# Altium project HELIA Lights 2022 V1.0.PrjPcb
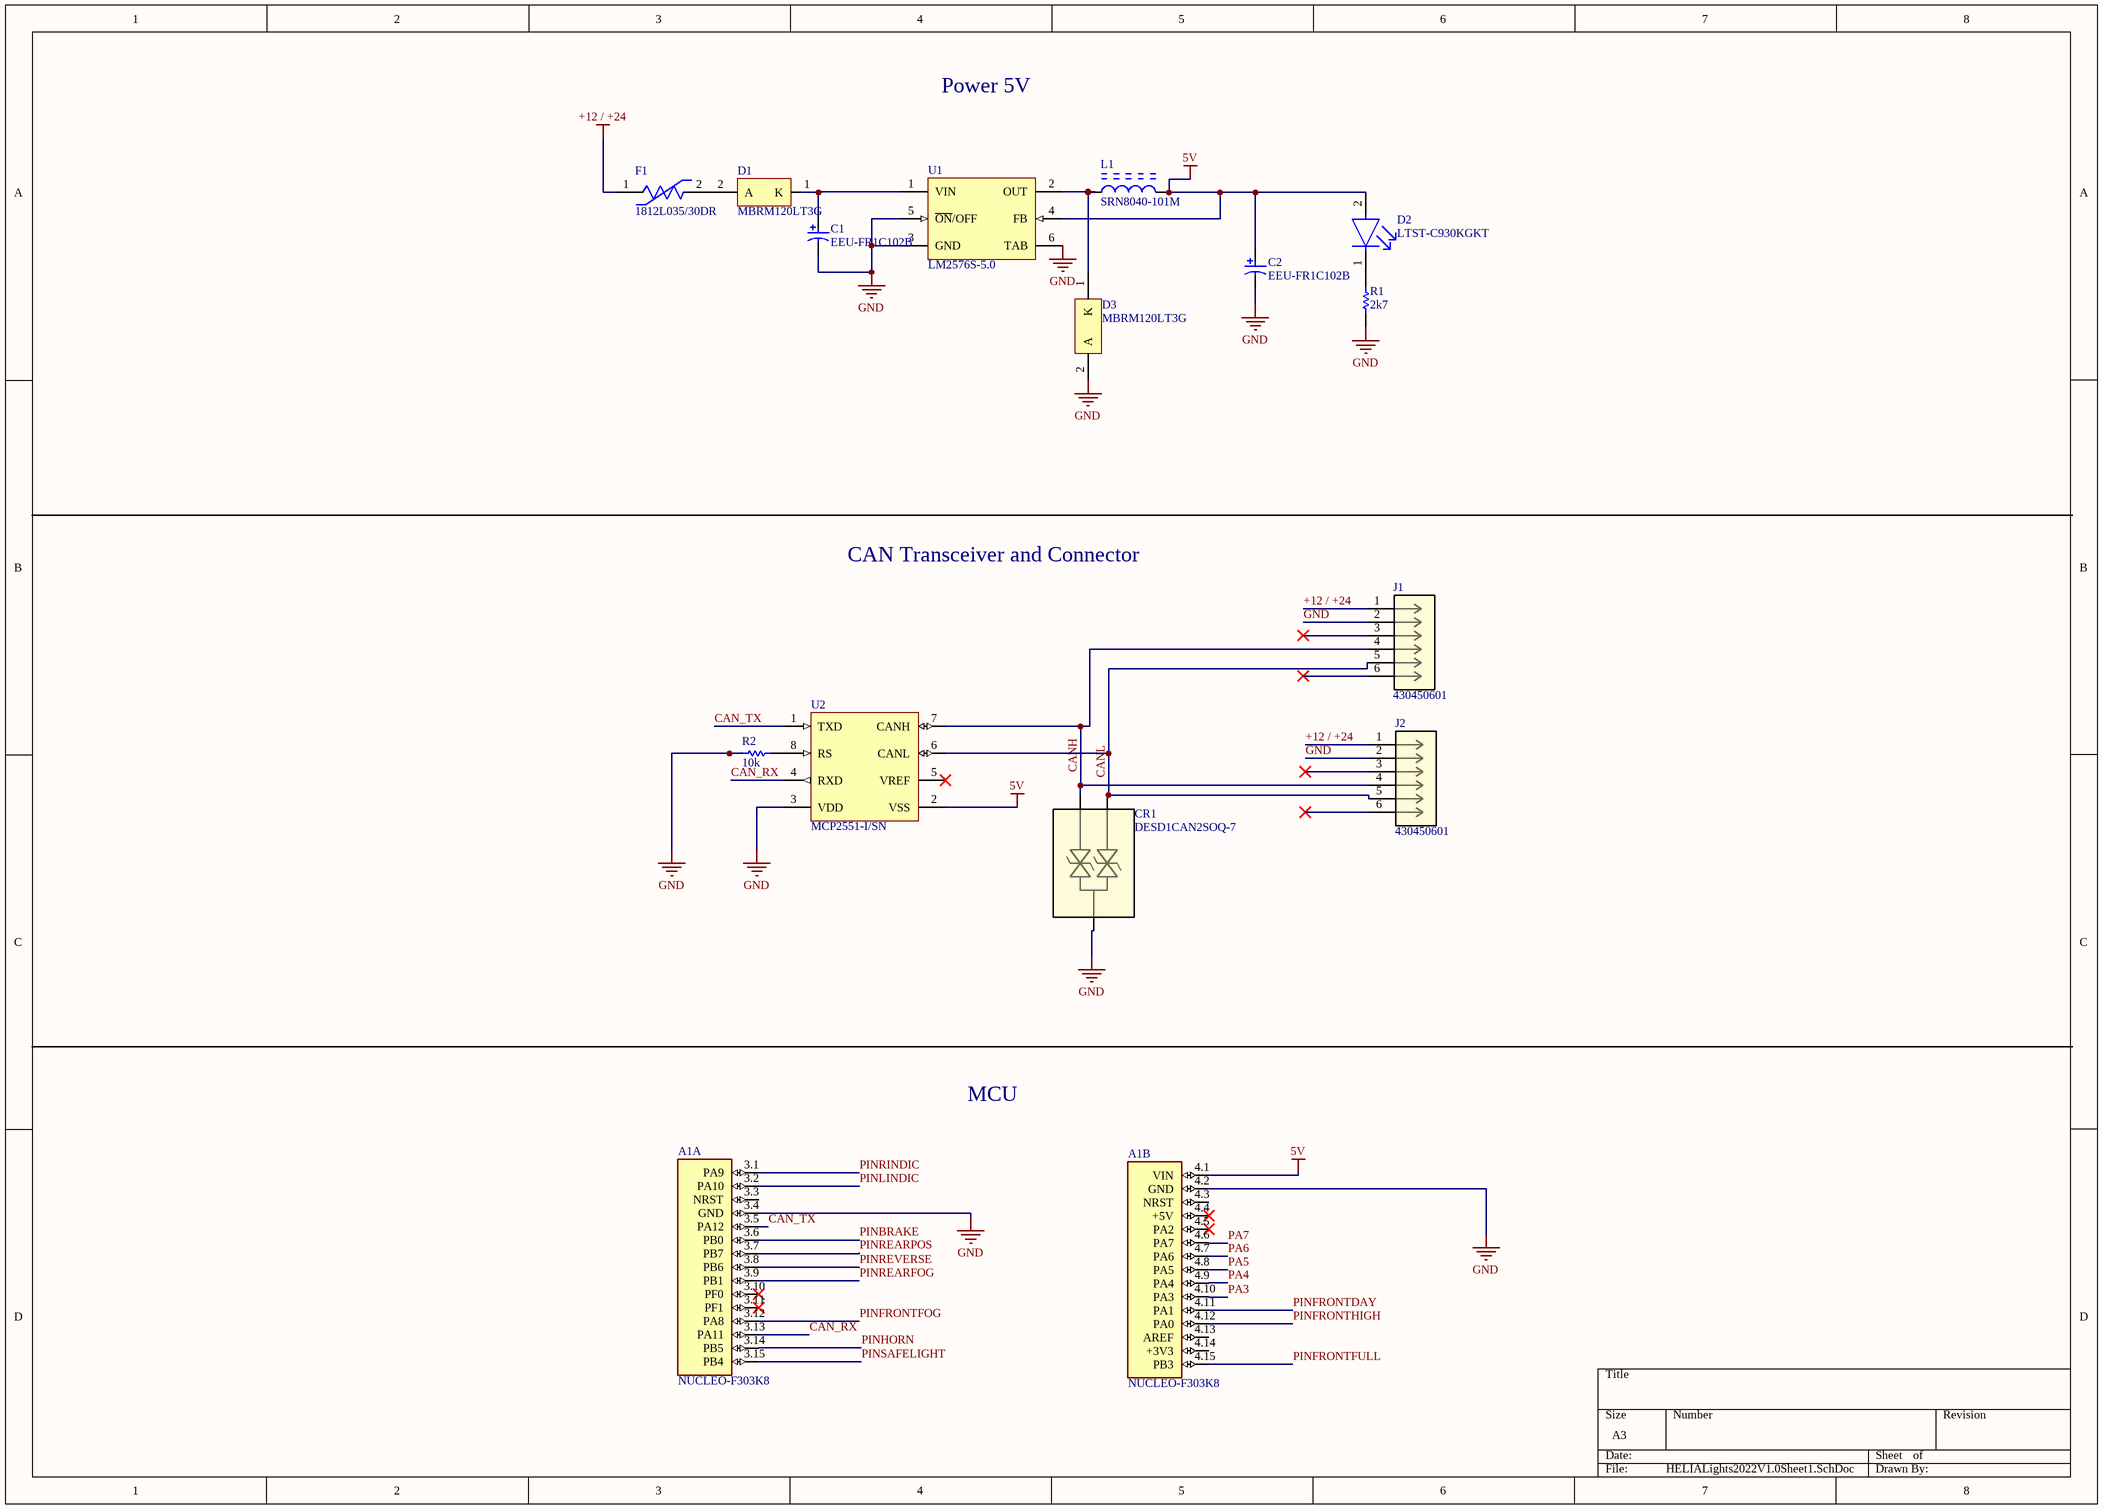
[diagram p0: HELIALights2022V1.0Sheet1.SchDoc]
2 sheets, 70 parts. Net scope: global (net labels, ports and power ports of the same name join across sheets).
Board file: HELIA Lights 2022 V1.0.PcbDoc
Sheets:
  HELIALights2022V1.0Sheet1.SchDoc
  HELIALights2022V1.0Sheet2.SchDoc

## Sheet HELIALights2022V1.0Sheet1.SchDoc: HELIA Lights
size A3; Author: Jeremias Pohle; CompanyName: CUER; DrawnBy: Jeremias Pohle; Engineer: Jeremias Pohle; Organization: University of Cambridge; Revision: 1.0; SheetNumber: 1; SheetTotal: 2

### Parts
A1  NUCLEO-F303K8  [MODULE_NUCLEO-F303K8]  (parts A,B of 2)
C1  EEU-FR1C102B  [PNSC-EEUFM1H221-2]
C2  EEU-FR1C102B  [PNSC-EEUFM1H221-2]
CR1  DESD1CAN2SOQ-7  [DIODE3_DESD1CAN2SOQ-7_DIO]
D1  MBRM120LT3G  [ONSC-POWERMITE-2-457-04_D_V]
D2  LTST-C930KGKT  [FP-LTST-C930KGKT-MFG]
D3  MBRM120LT3G  [ONSC-POWERMITE-2-457-04_D_V]
F1  1812L035/30DR  [FP-1812L035-30DR-MFG]
J1  430450601  [CON_430450601_MOL]
J2  430450601  [CON_430450601_MOL]
L1  SRN8040-101M  [BOUR-SRN8040-101M_V]
R1  2k7  [RESC1609X50X30NL8T20]
R2  10k  [RESC1609X50X30NL8T20]
U1  LM2576S-5.0  [KTT0005B_N]
U2  MCP2551-I/SN  [MCHP-SN8_V]

### Nets
5V: A1.4.1(VIN) C2.1 D2.2(A) L1.2 U1.4(FB) U2.2(VSS)
+12 / +24: F1.1 J1.1 J2.1
GND: A1.3.4(GND) A1.4.2(GND) C1.2 C2.2 CR1.3 D3.2(A) J1.2 J2.2 R1.1 R2.2 U1.3(GND) U1.5(~{ON}/OFF) U1.6(TAB) U2.3(VDD)
CAN_RX: A1.3.13(PA11) U2.4(RXD)
CAN_TX: A1.3.5(PA12) U2.1(TXD)
CANH: CR1.2 J1.4 J2.4 U2.7(CANH)
CANL: CR1.1 J1.5 J2.5 U2.6(CANL)
PA3: A1.4.10(PA3)
PA4: A1.4.9(PA4)
PA5: A1.4.8(PA5)
PA6: A1.4.7(PA6)
PA7: A1.4.6(PA7)
PINBRAKE: A1.3.6(PB0)
PINFRONTDAY: A1.4.11(PA1)
PINFRONTFOG: A1.3.12(PA8)
PINFRONTFULL: A1.4.15(PB3)
PINFRONTHIGH: A1.4.12(PA0)
PINHORN: A1.3.14(PB5)
PINLINDIC: A1.3.2(PA10)
PINREARFOG: A1.3.9(PB1)
PINREARPOS: A1.3.7(PB7)
PINREVERSE: A1.3.8(PB6)
PINRINDIC: A1.3.1(PA9)
PINSAFELIGHT: A1.3.15(PB4)
NetC1_1: C1.1 D1.1(K) U1.1(VIN)
NetD1_2: D1.2(A) F1.2
NetD2_1: D2.1(C) R1.2
NetD3_1: D3.1(K) L1.1 U1.2(OUT)
NetR2_1: R2.1 U2.8(RS)

Not connected (* = marked no-connect by the designer): A1 3.3(NRST) 3.10(PF0)* 3.11(PF1)* 4.3(NRST) 4.4(+5V)* 4.5(PA2)* 4.13(AREF) 4.14(+3V3); J1 3* 6*; J2 3* 6*; U2 5(VREF)*

### Notes on the sheet
- Power 5V
- CAN Transceiver and Connector
- MCU

### Library data of the parts
A1 = NUCLEO-F303K8: STM32F303K8, mbed-Enabled Development Nucleo-32 STM32F3 ARMÂ® CortexÂ®-M4 MCU 32-Bit Embedded Evaluation Board; MF: STMicroelectronics; MP: NUCLEO-F303K8; SnapEDA_Link: https://www.snapeda.com/parts/NUCLEO-F303K8/STMicroelectronics/view-part/276791/?ref=snap; Availability: Unavailable; Package: None; Value: *; Price: None
C1 C2 = CMP-2000-05313-1: Aluminum Electrolytic Capacitor, 1000 uF, +/- 20%, 16 V, -40 to 105 degC, 2-Pin THD, RoHS, Tape and Reel; Manufacturer: Panasonic; Capacitance: 1000µF; Ripple Current: 1790mA; Rated Voltage: 16V; Impedance: 0.028O; Type: Radial; Lifetime@Temperature: 8000Hrs@105degC; Operating Temp-Max: 105degC; Operating Temp Range: -40to+105degC; Manufacturer URL: http://www.panasonic.com/; Datasheet URL: http://www.produktinfo.conrad.com/datenblaetter/425000-449999/446746-da-01-en-ALU_KONDENSATOR_FR_R_1000_UF_16V.pdf; Case Size/Dimension: Ø10x16mm; Datasheet Version: Nov-11; Series: FR
CR1 = DESD1CAN2SOQ-7: No Description Available; Mfr_Name: Diodes Inc; Type: DEV; Copyright: Copyright (C) 2022 Ultra Librarian. All rights reserved.; Manufacturer_Part_Number: DESD1CAN2SOQ-7; RefDes: RefDes
D1 D3 = CMP-1055-00263-1: Schottky Power Rectifier, 2-Pin Powermite, Pb-Free, Tape and Reel; PartNumber: MBRM120LT1G; Manufacturer: On Semiconductor; IFSM Max (A): 50; Configuration: Single; ComponentLink1Description: Manufacturer URL; ComponentLink3URL: http://www.onsemi.com/pub_link/Collateral/457-04.PDF; PackageDescription: 2-Pin POWERMITE, Body 1.965 x 1.9 mm; DatasheetVersion: Rev. 7; Mounting Technology: Surface Mount; ComponentLink1URL: http://www.onsemi.com/; PackageVersion: Rev. F, 05/2013; ComponentLink2Description: Datasheet; PackageReference: POWERMITE-2-457-04; RoHS: TRUE; Packing: Tape and Reel; ComponentLink2URL: http://www.onsemi.cn/pub_link/Collateral/MBRM120L-D.PDF; ComponentLink3Description: Package Specification
D2 = CMP-2000-06626-2: LED GREEN CLEAR CHIP SMD; Power Rating: 75mW; Lens Style: Diffused; Number of Elements: 1; Test Current: 20mA; Reverse Voltage: 5V; Lens Color: Colorless; Wavelength: 574nm; Viewing Angle: 25°; Forward Voltage: 2V; Luminous Intensity: 600mcd; Forward Current: 30mA; Dominant Wavelength: 571nm; Illumination Color: Green; Number of LEDs: 1; RoHS Compliant: Yes; Length: 3.2mm; Max Operating Temperature: 85°C; Height: 2.4mm; Lens Transparency: Clear; Series: -; Case/Package: 1209; Case Code (Metric): 3224; Depth: 2.4mm; Packaging: Tape and Reel; Number of Pins: 2; Package Quantity: 1; Case Code (Imperial): 1209; Radiation Hardening: No; Mount: Surface Mount; Power Dissipation: 75mW; Min Operating Temperature: -55°C; Lead Free: Lead Free; Voltage: 5V; Color: Green; Width: 2.4mm
F1 = CMP-08606-000005-1: PTC RESET FUSE 30V 350MA 1812; Manufacturer: Littelfuse Inc; Trip Time: 0.15s; Hold Current: 0.35A; Value: 0.4-1.7Ω; Trip Current: 0.75A; Current Rating: 40A; Temperature Range High: +85°C; Ambient Temperature Range High: +85°C; Device Class L2: PTC Resettable Fuses; RoHS: TRUE; Digikey Description: PTC RESET FUSE 30V 350MA 1812; ComponentLink2URL: https://www.littelfuse.com/~/media/electronics/datasheets/resettable_ptcs/littelfuse_ptc_1812l_datasheet.pdf.pdf; Lead Free: Yes; Ambient Temperature Range Low: -40°C; Manufacturer Part Number: 1812L035/30DR; Automotive: No; Category: Fuse; Octopart: https://octopart.com/1812l035%2F30dr-littelfuse-19645438; Device Class L3: unset; Device Class L1: Circuit Protection; Temperature Range Low: -40°C; Mouser Description: Resettable Fuses - PPTC PTC 30V POLY 1812 HALOGEN-FREE .35A; Package: 0; Voltage Rating: 30V; ComponentLink2Description: Datasheet; Temperature: -40°C to +85°C; Resistance: 0.4-1.7Ω; Height: 1.25mm
J1 J2 = 430450601: No Description Available; Mfr_Name: Molex Connector Corporation; Copyright: Copyright (C) 2022 Ultra Librarian. All rights reserved.; Manufacturer_Part_Number: 430450601; RefDes: RefDes; Type: DEV
L1 = CMP-2000-07143-1: Semi-Shielded Power Inductor, 100 uH, -40 to 125 degC, 2-Pin SMD, RoHS, Tape and Reel; Manufacturer: Bourns; Tolerance: ±20 / %; Brand/Series: SRN8040Series; Current, Rating: 1 / A; Inductance: 100 / µH; Manufacturer URL: http://www.bourns.com/; Package Description: 2-Pin Surface Mount Device, Body 8 x 8 mm; Datasheet URL: http://www.produktinfo.conrad.com/datenblaetter/1000000-1099999/001056456-da-01-en-MAG_ABG_LEIST_IND_SRN8040_101M_100UH_SMD.pdf; Datasheet Version: 08/2013; Termination: SMT; Type: Power; Mounting Technology: SurfaceMount; Package Reference: SRN8040-101M
R1 R2 = CMP-2000-03816-5: Chip Resistor, 0 Ohm, Jumper, 100 mW, -55 to 155 degC, 0603 (1608 Metric), RoHS, Tape and Reel; Manufacturer: Vishay Semiconductor; Voltage Rating: 75 V; Package Quantity: 5000; DatasheetVersion: 06/2012; Min Operating Temperature: -55 degC; ComponentLink1URL: http://www.vishay.com/; Mounting Technology: Surface Mount; Height: 0.45 mm; ComponentLink1Description: Manufacturer URL; REACH SVHC: Unknown; PackageReference: 0603; Packaging: Tape and Reel; Max Operating Temperature: 155 degC; Mount: Surface Mount; ComponentLink2Description: Datasheet; PackageDescription: 2-Pin Surface Mount Device, Body 1.575 x 0.85 mm; Length: 1.55 mm; ComponentLink2URL: http://www.vishay.com/docs/20035/dcrcwe3.pdf; Pins: 2; RoHSCompliant: true
U1 = CMP-0069-00115-3: SIMPLE SWITCHER® 3A Step-Down Voltage Regulator, 5-pin TO-263; Manufacturer: Texas Instruments; PackageTopMarking: NSUZXYTTE#*LM2576S*-5.0 P+; PowerWise: N; ComponentLink1Description: Datasheet URL; CompType: Switcher; PinCount: 5; Code_JEDEC: MO-169-AB; PackageDescription: TO-263, Molded, .400 x .390 x .180in, 5 Lead, .067in Pitch, Surface Mount; ComponentLink1URL: http://www.ti.com/general/docs/lit/getliterature.tsp?genericPartNumber=LM2576&fileType=pdf; RoHS: N; PackageReference: KTT0005B
U2 = CMP-0186-00138-3: High-Speed CAN Transceiver, / 1 Mb/s, 4.5 to 5.5 V, 8-Pin SOIC (SN), Industrial Temperature, RoHS, Tube; Manufacturer: Microchip; RoHSCompliant: true; PackageReference: SN8; ComponentLink1URL: http://www.microchip.com/; DatasheetVersion: Rev. F, 07/2010; ComponentLink2Description: Datasheet; ComponentLink2URL: http://ww1.microchip.com/downloads/en/DeviceDoc/21667f.pdf; ComponentLink3Description: Package Specification; PackageDescription: 8-Pin Small Outline Integrated Circuit, Body 4.9 x 3.9 mm, Pitch 1.27 mm; ComponentLink1Description: Manufacturer URL; Mounting Technology: Surface Mount; ComponentLink3URL: http://www.microchip.com/stellent/groups/techpub_sg/documents/packagingspec/en012702.pdf

## Sheet HELIALights2022V1.0Sheet2.SchDoc
size A3; SheetNumber: 2; SheetTotal: 2
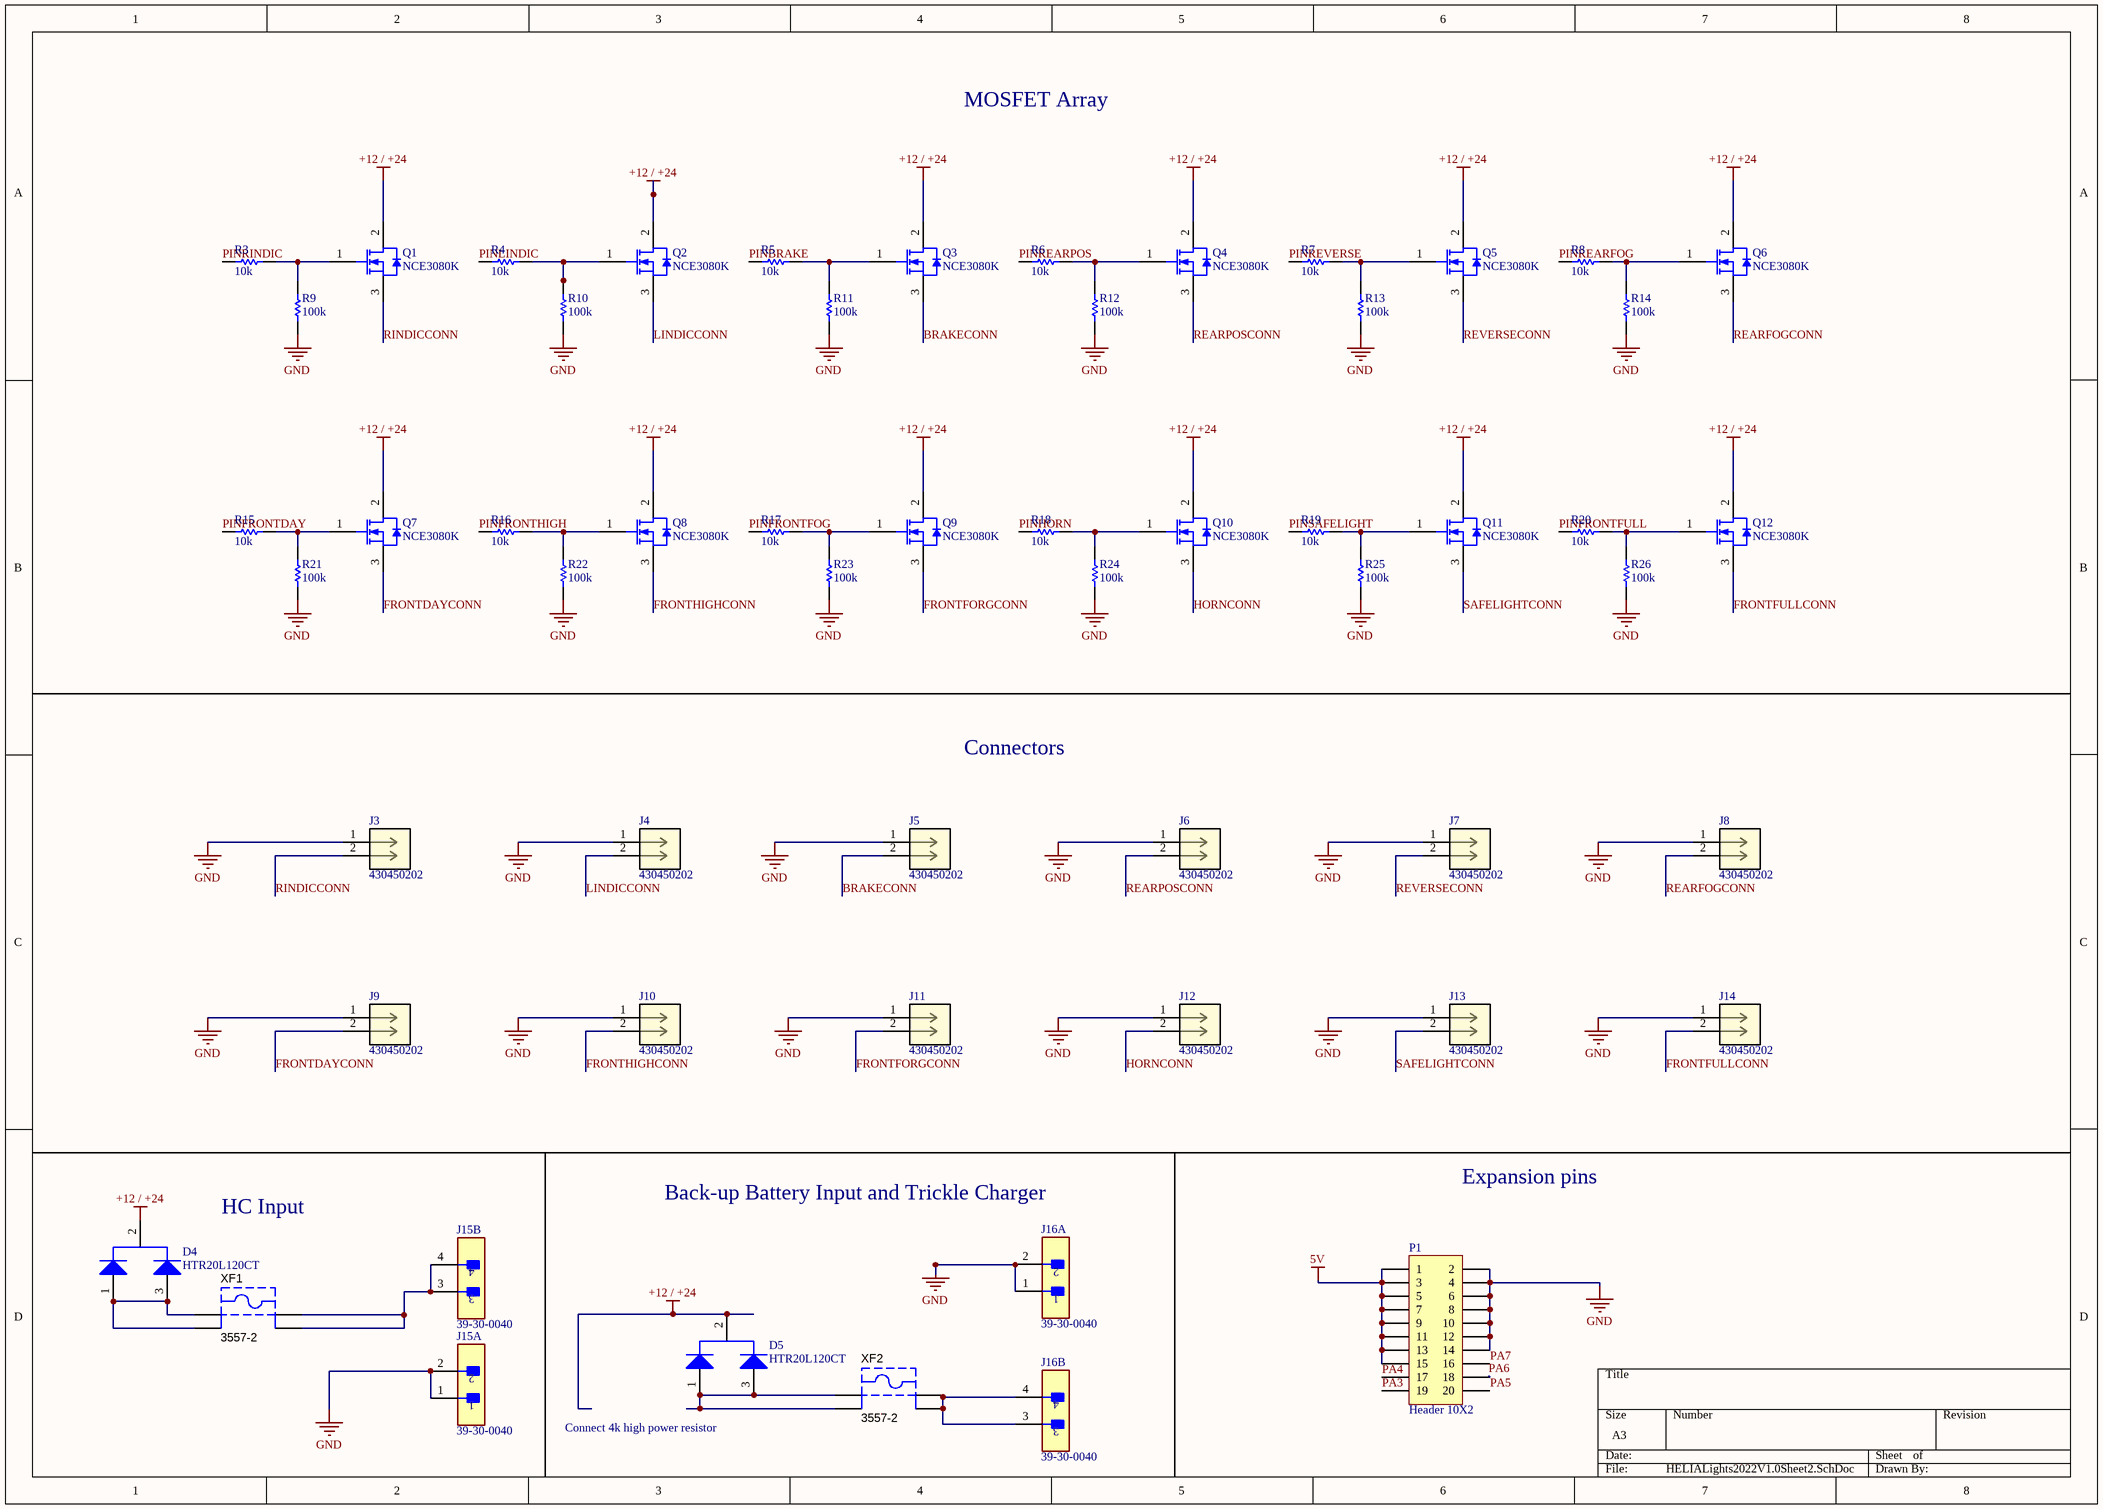
[diagram p1: HELIALights2022V1.0Sheet2.SchDoc]

### Parts
D4  HTR20L120CT  [ONSC-TO-220-3-221A-09]
D5  HTR20L120CT  [ONSC-TO-220-3-221A-09]
J3  430450202  [CON_430450202_MOL]
J4  430450202  [CON_430450202_MOL]
J5  430450202  [CON_430450202_MOL]
J6  430450202  [CON_430450202_MOL]
J7  430450202  [CON_430450202_MOL]
J8  430450202  [CON_430450202_MOL]
J9  430450202  [CON_430450202_MOL]
J10  430450202  [CON_430450202_MOL]
J11  430450202  [CON_430450202_MOL]
J12  430450202  [CON_430450202_MOL]
J13  430450202  [CON_430450202_MOL]
J14  430450202  [CON_430450202_MOL]
J15  39-30-0040  [FP-39-30-0040-MFG]  (parts A,B of 2)
J16  39-30-0040  [FP-39-30-0040-MFG]  (parts A,B of 2)
P1  Header 10X2  [HDR2X10]
Q1  NCE3080K  [INF-PG-TO252-3-313_L]
Q2  NCE3080K  [INF-PG-TO252-3-313_L]
Q3  NCE3080K  [INF-PG-TO252-3-313_L]
Q4  NCE3080K  [INF-PG-TO252-3-313_L]
Q5  NCE3080K  [INF-PG-TO252-3-313_L]
Q6  NCE3080K  [INF-PG-TO252-3-313_L]
Q7  NCE3080K  [INF-PG-TO252-3-313_L]
Q8  NCE3080K  [INF-PG-TO252-3-313_L]
Q9  NCE3080K  [INF-PG-TO252-3-313_L]
Q10  NCE3080K  [INF-PG-TO252-3-313_L]
Q11  NCE3080K  [INF-PG-TO252-3-313_L]
Q12  NCE3080K  [INF-PG-TO252-3-313_L]
R3  10k  [RESC1609X50X30NL8T20]
R4  10k  [RESC1609X50X30NL8T20]
R5  10k  [RESC1609X50X30NL8T20]
R6  10k  [RESC1609X50X30NL8T20]
R7  10k  [RESC1609X50X30NL8T20]
R8  10k  [RESC1609X50X30NL8T20]
R9  100k  [RESC1609X50X30NL8T20]
R10  100k  [RESC1609X50X30NL8T20]
R11  100k  [RESC1609X50X30NL8T20]
R12  100k  [RESC1609X50X30NL8T20]
R13  100k  [RESC1609X50X30NL8T20]
R14  100k  [RESC1609X50X30NL8T20]
R15  10k  [RESC1609X50X30NL8T20]
R16  10k  [RESC1609X50X30NL8T20]
R17  10k  [RESC1609X50X30NL8T20]
R18  10k  [RESC1609X50X30NL8T20]
R19  10k  [RESC1609X50X30NL8T20]
R20  10k  [RESC1609X50X30NL8T20]
R21  100k  [RESC1609X50X30NL8T20]
R22  100k  [RESC1609X50X30NL8T20]
R23  100k  [RESC1609X50X30NL8T20]
R24  100k  [RESC1609X50X30NL8T20]
R25  100k  [RESC1609X50X30NL8T20]
R26  100k  [RESC1609X50X30NL8T20]
XF1  3557-2  [KSTN-3557-2]
XF2  3557-2  [KSTN-3557-2]

### Nets
5V: P1.1 P1.3 P1.5 P1.7 P1.9 P1.11 P1.13 P1.15
+12 / +24: D4.2(K) D5.2(K) Q1.2(DRAIN) Q2.2(DRAIN) Q3.2(DRAIN) Q4.2(DRAIN) Q5.2(DRAIN) Q6.2(DRAIN) Q7.2(DRAIN) Q8.2(DRAIN) Q9.2(DRAIN) Q10.2(DRAIN) Q11.2(DRAIN) Q12.2(DRAIN)
GND: J3.1 J4.1 J5.1 J6.1 J7.1 J8.1 J9.1 J10.1 J11.1 J12.1 J13.1 J14.1 J15.1 J15.2 J16.1 J16.2 P1.2 P1.4 P1.6 P1.8 P1.10 P1.12 P1.14 R9.2 R10.2 R11.2 R12.2 R13.2 R14.2 R21.2 R22.2 R23.2 R24.2 R25.2 R26.2
BRAKECONN: J5.2 Q3.3(SOURCE)
FRONTDAYCONN: J9.2 Q7.3(SOURCE)
FRONTFORGCONN: J11.2 Q9.3(SOURCE)
FRONTFULLCONN: J14.2 Q12.3(SOURCE)
FRONTHIGHCONN: J10.2 Q8.3(SOURCE)
HORNCONN: J12.2 Q10.3(SOURCE)
LINDICCONN: J4.2 Q2.3(SOURCE)
PA3: P1.19
PA4: P1.17
PA5: P1.20
PA6: P1.18
PA7: P1.16
PINBRAKE: R5.2
PINFRONTDAY: R15.2
PINFRONTFOG: R17.2
PINFRONTFULL: R20.2
PINFRONTHIGH: R16.2
PINHORN: R18.2
PINLINDIC: R4.2
PINREARFOG: R8.2
PINREARPOS: R6.2
PINREVERSE: R7.2
PINRINDIC: R3.2
PINSAFELIGHT: R19.2
REARFOGCONN: J8.2 Q6.3(SOURCE)
REARPOSCONN: J6.2 Q4.3(SOURCE)
REVERSECONN: J7.2 Q5.3(SOURCE)
RINDICCONN: J3.2 Q1.3(SOURCE)
SAFELIGHTCONN: J13.2 Q11.3(SOURCE)
NetD4_1: D4.1(A1) D4.3(A2) XF1.1 XF1.2
NetD5_1: D5.1(A1) D5.3(A2) XF2.1 XF2.2
NetJ15_3: J15.3 J15.4 XF1.3 XF1.4
NetJ16_3: J16.3 J16.4 XF2.3 XF2.4
NetQ1_1: Q1.1(GATE) R3.1 R9.1
NetQ2_1: Q2.1(GATE) R4.1 R10.1
NetQ3_1: Q3.1(GATE) R5.1 R11.1
NetQ4_1: Q4.1(GATE) R6.1 R12.1
NetQ5_1: Q5.1(GATE) R7.1 R13.1
NetQ6_1: Q6.1(GATE) R8.1 R14.1
NetQ7_1: Q7.1(GATE) R15.1 R21.1
NetQ8_1: Q8.1(GATE) R16.1 R22.1
NetQ9_1: Q9.1(GATE) R17.1 R23.1
NetQ10_1: Q10.1(GATE) R18.1 R24.1
NetQ11_1: Q11.1(GATE) R19.1 R25.1
NetQ12_1: Q12.1(GATE) R20.1 R26.1

### Notes on the sheet
- MOSFET Array
- Connectors
- Expansion pins
- HC Input
- Back-up Battery Input and Trickle Charger
- Connect 4k high power resistor

### Library data of the parts
D4 D5 = CMP-1055-00618-1: SWITCHMODE(TM) Power Rectifier, 60 V, 30 A, 3-Pin TO-220, Pb-Free, Tube; Manufacturer: On Semiconductor; PartNumber: MBR30H60CTG; Configuration: Common Cathode; IFSM Max (A): 260; RoHS: TRUE; Packing: Tube; ComponentLink3Description: Package Specification; PackageVersion: Rev. AG, 09/2011; DatasheetVersion: Rev. 10; PackageDescription: 3-Pin Flange Mount, Vertical Straight Lead, Body 9.97 x 4.445 mm, Pitch 2.54 mm; ComponentLink1Description: Manufacturer URL; ComponentLink1URL: http://www.onsemi.com/; Mounting Technology: Through Hole; ComponentLink2Description: Datasheet; ComponentLink3URL: http://www.onsemi.com/pub_link/Collateral/221A-09.PDF; ComponentLink2URL: http://www.onsemi.cn/pub_link/Collateral/MBRB30H60CT-D.PDF; PackageReference: TO-220-3-221A-09
J3-J14 = 430450202: No Description Available; Mfr_Name: Molex Connector Corporation; Copyright: Copyright (C) 2022 Ultra Librarian. All rights reserved.; Manufacturer_Part_Number: 430450202; RefDes: RefDes; Type: DEV
J15 J16 = CMP-2000-05600-2: CONN HEADER R/A 4POS 4.2MM; Manufacturer: Molex; Current Rating: 13A; Voltage Rating: 600V; Number Of Contacts: 4; Standoff Height: 0.4mm; Conn Orientation: Right Angle; Conn Gender: Male; Device Class L1: Connectors; Pitch: 4.2mm; Package: 39-30-0040; Octopart: https://octopart.com/39-30-0040-molex-277428; Mouser Description: Headers & Wire Housings 4 CKT R/A HEADER; Temperature Range High: +105°C; Number Of Rows: 2; ComponentLink2Description: Datasheet; ComponentLink2URL: https://www.molex.com/webdocs/datasheets/pdf/en-us/0039300040_PCB_HEADERS.pdf; Manufacturer Part Number: 39-30-0040; Contact Material: Gold,Nickel; Digikey Description: CONN HEADER R/A 4POS 4.2MM; Temperature: -40°C to +105°C; Automotive: No; Device Class L2: Headers and Wire Housings; RoHS: TRUE; Lead Free: Yes; Device Class L3: unset; Category: Conn; Footprint Url: https://www.molex.com/pdm_docs/sd/039300040_sd.pdf; Temperature Range Low: -40°C
P1 = Header 10X2: Header, 10-Pin, Dual row; LatestRevisionDate: 17-Jul-2002; LatestRevisionNote: Re-released for DXP Platform.; Publisher: Altium Limited
Q1-Q12 = CMP-1164-00349-1: N-Channel CoolMOS E6 Power-Transistor, 600 V VDS, 7.3 A ID, -55 to 150 degC, PG-TO252-3-313, Reel, Green; Manufacturer: Infineon; PartNumber: IPD60R600C6; IDpuls (max): 19Â A; VDS (max): 600Â V; VGS(th) (min): 2.5Â V; Ptot (max): 63Â W; Rth: 2Â K/W; VGS(th) (max): 3.5Â V; QG: 20.5Â nC; Green: TRUE; RDS (on) (max): 600Â mOhm; ID (max): 7.3Â A; RthJA (max): 62Â K/W; Polarity: N; Packing: Reel; PackageVersion: Oct-10; ComponentLink3Description: Package Specification; ComponentLink3URL: http://www.infineon.com/dgdl/PG-TO252-3-313-Package_Overview.pdf?folderId=db3a30432b57a660012b81890ade72d2&fileId=db3a30432b57a660012b8193af2872eb; Mounting Technology: Surface Mount; Technology: CoolMOS C6; PackageDescription: 3-Pin Plastic (Green) Transistor Single Outline Package, 6.5 x 6.12 mm Body, 2.28 mm Pitch; ComponentLink2Description: Datasheet; RthJC (max): 2Â K/W; ComponentLink1Description: Manufacturer URL; ComponentLink1URL: http://www.infineon.com/; ComponentLink2URL: http://www.infineon.com/dgdl/IPD60R600C6_2_0.pdf?folderId=db3a30431ff98815012019af55de3f2c&fileId=db3a30432239cccd0122a83152b97d6f; PackageReference: PG-TO252-3-313; DatasheetVersion: Rev. 2.0
R3-R26 = CMP-2000-03816-5: as R1 on sheet HELIALights2022V1.0Sheet1; Package Quantity: 5000; DatasheetVersion: 06/2012; Min Operating Temperature: -55 degC; ComponentLink1URL: http://www.vishay.com/; Mounting Technology: Surface Mount; Height: 0.45 mm; ComponentLink1Description: Manufacturer URL; REACH SVHC: Unknown; PackageReference: 0603; Packaging: Tape and Reel; Max Operating Temperature: 155 degC; Mount: Surface Mount; ComponentLink2Description: Datasheet; PackageDescription: 2-Pin Surface Mount Device, Body 1.575 x 0.85 mm; Length: 1.55 mm; ComponentLink2URL: http://www.vishay.com/docs/20035/dcrcwe3.pdf; Pins: 2; RoHSCompliant: true
XF1 XF2 = CMP-2000-05461-1: FUSE HOLDER, PCB MOUNT, 500VAC, 20A, ROHS; Manufacturer: Keystone-Electronics; Number of Circuits: 1; Voltage: 500V; Fuseholder Type: Block; Fuse Type: Blade; Fuse Size: 0.43"Lx0.15"Wx0.64"H(10.92mmx3.81mmx16.25mm); For Use With/Related Products: ATC,ATO257,MINI897; Current Rating: 30A; Datasheet URL: http://datasheet.octopart.com/3557-2-Keystone-datasheet-15715937.pdf; Orientation: Vertical; Family: Fuseholders; Datasheet Version: Apr-13; Contact Finish: TinNickel; Mounting Type: PCB; Series: -; Category: CircuitProtection; Termination Style: PCPin; Contact Material: Brass; Manufacturer URL: http://www.keyelco.com/

## Nets that join several sheets
5V: HELIALights2022V1.0Sheet1 (6 pins), HELIALights2022V1.0Sheet2 (8 pins)
+12 / +24: HELIALights2022V1.0Sheet1 (F1.1 J1.1 J2.1), HELIALights2022V1.0Sheet2 (14 pins)
GND: HELIALights2022V1.0Sheet1 (14 pins), HELIALights2022V1.0Sheet2 (35 pins)
PA3: HELIALights2022V1.0Sheet1 (A1.4.10), HELIALights2022V1.0Sheet2 (P1.19)
PA4: HELIALights2022V1.0Sheet1 (A1.4.9), HELIALights2022V1.0Sheet2 (P1.17)
PA5: HELIALights2022V1.0Sheet1 (A1.4.8), HELIALights2022V1.0Sheet2 (P1.20)
PA6: HELIALights2022V1.0Sheet1 (A1.4.7), HELIALights2022V1.0Sheet2 (P1.18)
PA7: HELIALights2022V1.0Sheet1 (A1.4.6), HELIALights2022V1.0Sheet2 (P1.16)
PINBRAKE: HELIALights2022V1.0Sheet1 (A1.3.6), HELIALights2022V1.0Sheet2 (R5.2)
PINFRONTDAY: HELIALights2022V1.0Sheet1 (A1.4.11), HELIALights2022V1.0Sheet2 (R15.2)
PINFRONTFOG: HELIALights2022V1.0Sheet1 (A1.3.12), HELIALights2022V1.0Sheet2 (R17.2)
PINFRONTFULL: HELIALights2022V1.0Sheet1 (A1.4.15), HELIALights2022V1.0Sheet2 (R20.2)
PINFRONTHIGH: HELIALights2022V1.0Sheet1 (A1.4.12), HELIALights2022V1.0Sheet2 (R16.2)
PINHORN: HELIALights2022V1.0Sheet1 (A1.3.14), HELIALights2022V1.0Sheet2 (R18.2)
PINLINDIC: HELIALights2022V1.0Sheet1 (A1.3.2), HELIALights2022V1.0Sheet2 (R4.2)
PINREARFOG: HELIALights2022V1.0Sheet1 (A1.3.9), HELIALights2022V1.0Sheet2 (R8.2)
PINREARPOS: HELIALights2022V1.0Sheet1 (A1.3.7), HELIALights2022V1.0Sheet2 (R6.2)
PINREVERSE: HELIALights2022V1.0Sheet1 (A1.3.8), HELIALights2022V1.0Sheet2 (R7.2)
PINRINDIC: HELIALights2022V1.0Sheet1 (A1.3.1), HELIALights2022V1.0Sheet2 (R3.2)
PINSAFELIGHT: HELIALights2022V1.0Sheet1 (A1.3.15), HELIALights2022V1.0Sheet2 (R19.2)